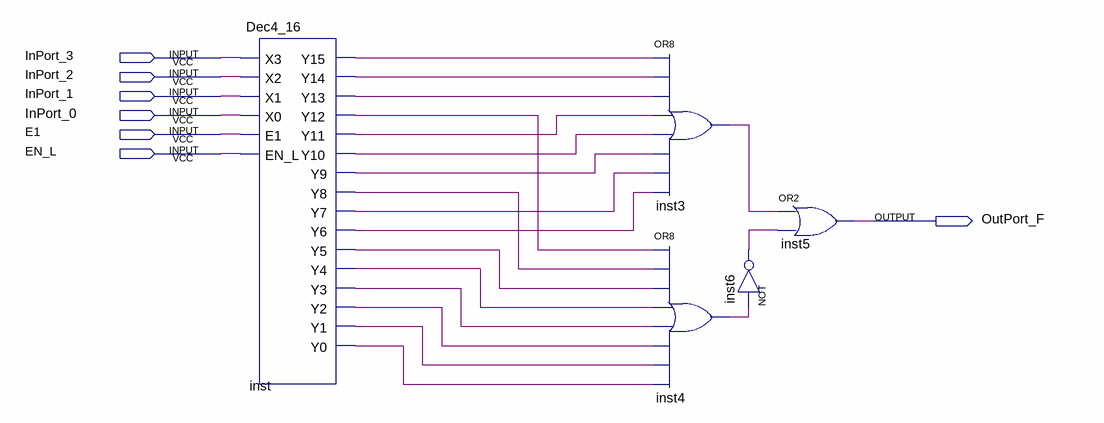
[diagram p0: schematic sheet]
// Quartus schematic DecoderDemo3.bdf as structural Verilog: 5 symbols, 7 pins
module DecoderDemo3 (
  input  InPort_3,
  input  InPort_2,
  input  InPort_1,
  input  InPort_0,
  input  E1,
  input  EN_L,
  output OutPort_F
);

  wire inst3_out, inst4_out, inst6_out, inst_y0, inst_y1, inst_y2, inst_y3, inst_y4, inst_y5, inst_y6,
       inst_y7, inst_y8, inst_y9, inst_y10, inst_y11, inst_y12, inst_y13, inst_y14, inst_y15;

  Dec4_16 inst (
    .X3(InPort_3), .X2(InPort_2), .X1(InPort_1), .X0(InPort_0), .E1(E1), .EN_L(EN_L), .Y15(inst_y15),
    .Y14(inst_y14), .Y13(inst_y13), .Y12(inst_y12), .Y11(inst_y11), .Y10(inst_y10), .Y9(inst_y9),
    .Y8(inst_y8), .Y7(inst_y7), .Y6(inst_y6), .Y5(inst_y5), .Y4(inst_y4), .Y3(inst_y3), .Y2(inst_y2),
    .Y1(inst_y1), .Y0(inst_y0));
  or inst3 (inst3_out, inst_y15, inst_y14, inst_y13, inst_y11, inst_y10, inst_y9, inst_y7, inst_y6);
  or inst4 (inst4_out, inst_y12, inst_y8, inst_y5, inst_y4, inst_y3, inst_y2, inst_y1, inst_y0);
  not inst6 (inst6_out, inst4_out);
  or inst5 (OutPort_F, inst3_out, inst6_out);
endmodule
